# EAGLE design AeroQuad_v210 (EAGLE 5.11)
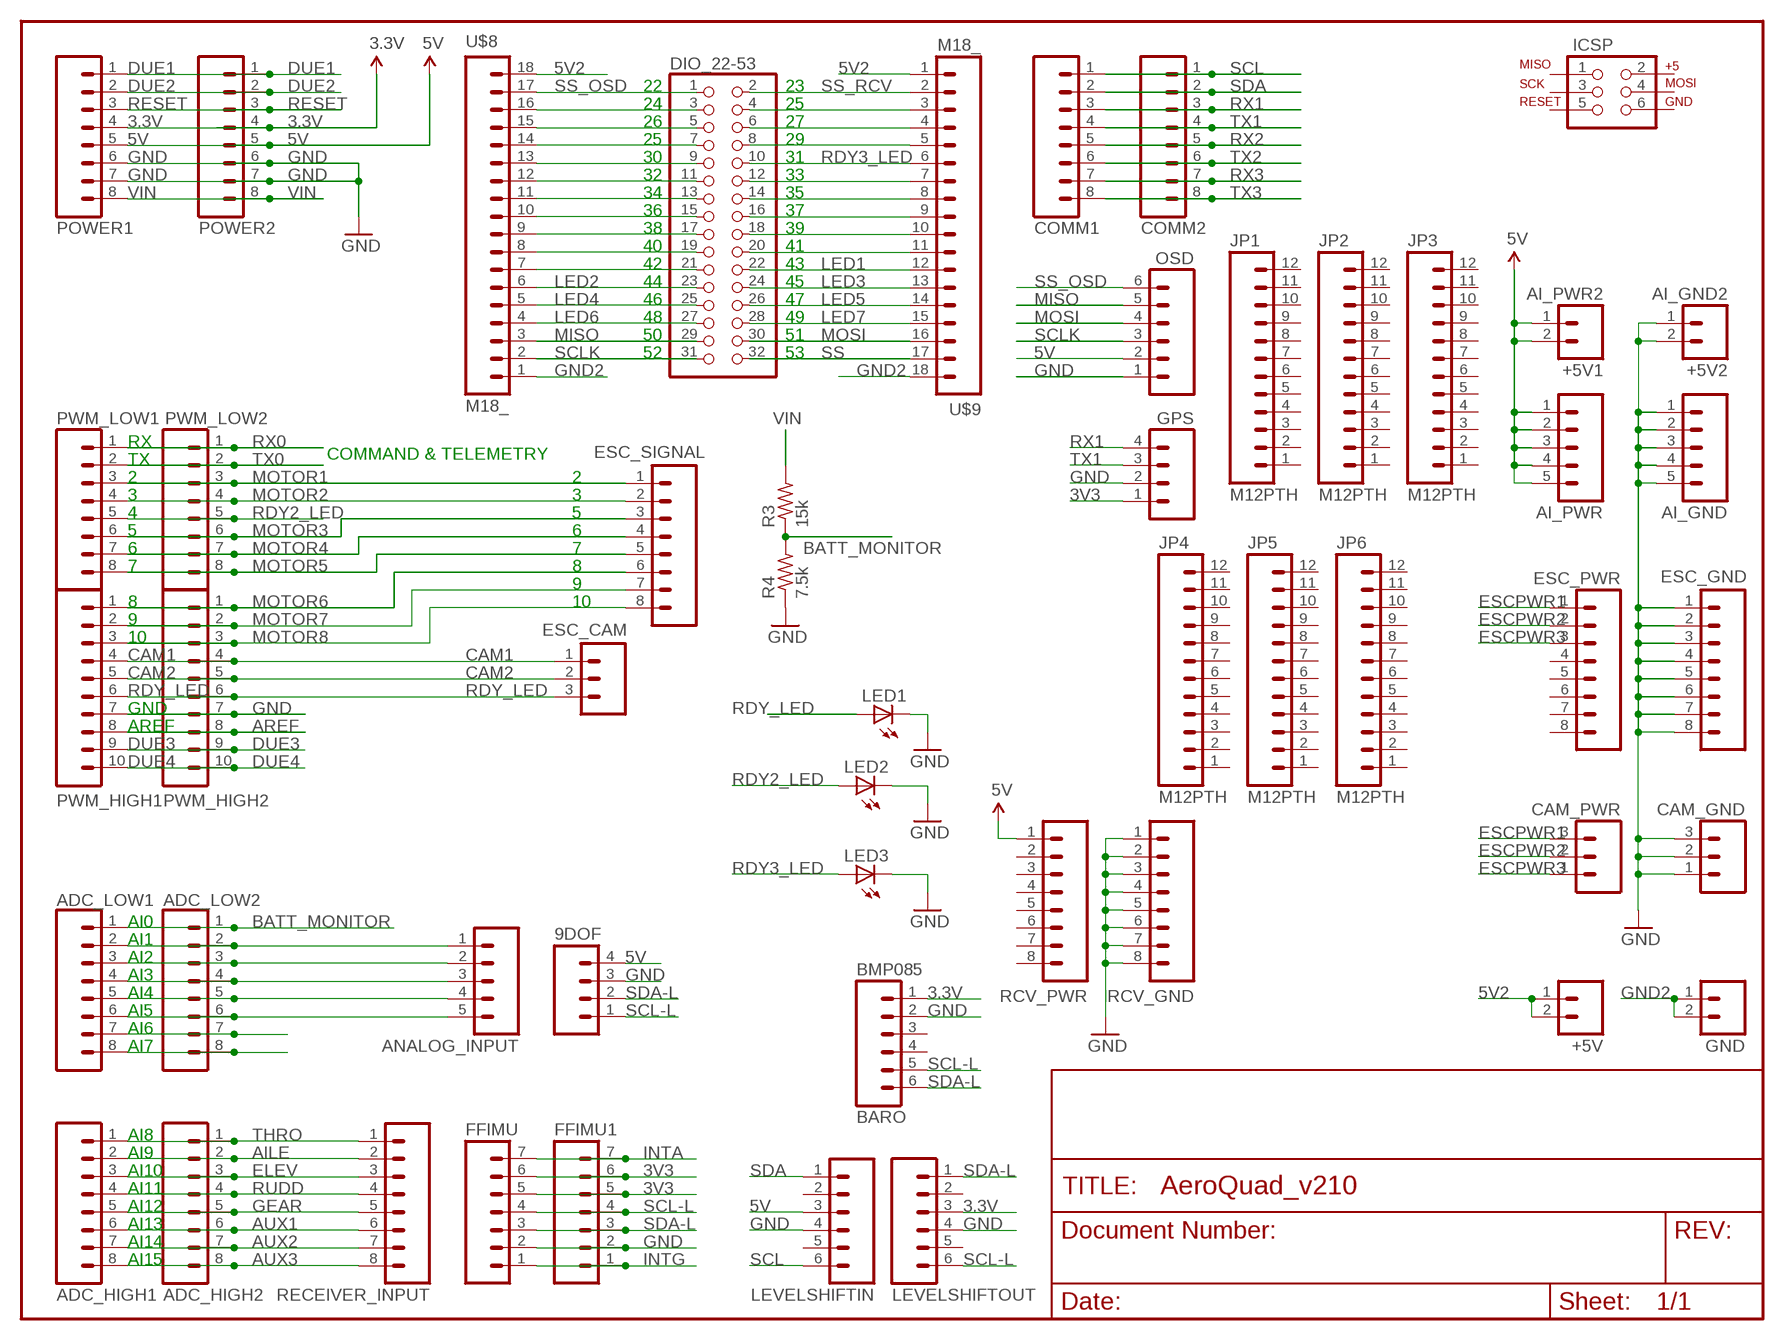
[diagram p0: schematic, sheet 1]

## Parts
9DOF  M04LOCK  [1X04_LOCK]
+5V  M02PTH  [1X02]
+5V1  AI_PWR2  M02PTH  [1X02]
+5V2  AI_GND2  M02PTH  [1X02]
ADC_HIGH1  M08LOCK  [1X08_LOCK]
ADC_HIGH2  M08LOCK  [1X08_LOCK]
ADC_LOW1  M08LOCK  [1X08_LOCK]
ADC_LOW2  M08LOCK  [1X08_LOCK]
AI_GND  M05LOCK  [1X05_LOCK]
AI_PWR  M05LOCK  [1X05_LOCK]
ANALOG_INPUT  M05LOCK  [1X05_LOCK]
BARO  BMP085  M06LOCK  [1X06_LOCK]
CAM_GND  M03LOCK  [1X03_LOCK]
CAM_PWR  M03LOCK  [1X03_LOCK]
COMM1  M08LOCK  [1X08_LOCK]
COMM2  M08LOCK  [1X08_LOCK]
DIO_22-53  PINHD-2X16  [2X16]
ESC_CAM  M03LOCK  [1X03_LOCK]
ESC_GND  M10LOCK  M08LOCK  [1X08_LOCK]
ESC_PWR  M10LOCK  M08LOCK  [1X08_LOCK]
ESC_SIGNAL  M10LOCK  M08LOCK  [1X08_LOCK]
FFIMU  M07LOCK  [1X07_LOCK]
FFIMU1  M07LOCK  [1X07_LOCK]
GND  M02PTH  [1X02]
GPS  M04LOCK  [1X04_LOCK]
ICSP  AVR_SPI_PRG_6NS  [2X3-NS]
JP1  M12PTH  [1X12]
JP2  M12PTH  [1X12]
JP3  M12PTH  [1X12]
JP4  M12PTH  [1X12]
JP5  M12PTH  [1X12]
JP6  M12PTH  [1X12]
LED1  LED5MM  [LED5MM]
LED2  LED5MM  [LED5MM]
LED3  LED5MM  [LED5MM]
LEVELSHIFTIN  M06LOCK  [1X06_LOCK]
LEVELSHIFTOUT  M06LOCK  [1X06_LOCK]
OSD  M06LOCK  [1X06_LOCK]
POWER1  M08LOCK  [1X08_LOCK]
POWER2  M08LOCK  [1X08_LOCK]
PWM_HIGH1  M10LOCK  [1X10_LOCK]
PWM_HIGH2  M10LOCK  [1X10_LOCK]
PWM_LOW1  M08LOCK  [1X08_LOCK]
PWM_LOW2  M08LOCK  [1X08_LOCK]
R3  15k  R-US_0204/5  [0204/5]
R4  7.5k  R-US_0204/5  [0204/5]
RCV_GND  M10LOCK  M08LOCK  [1X08_LOCK]
RCV_PWR  M10LOCK  M08LOCK  [1X08_LOCK]
RECEIVER_INPUT  M08LOCK  [1X08_LOCK]
U$8  M18_  [1X18]
U$9  M18_  [1X18]

## Nets
3.3V: BARO.1 LEVELSHIFTOUT.3 POWER1.4 POWER2.4
3V3: FFIMU1.5 FFIMU1.6 FFIMU.5 FFIMU.6 GPS.1
5V: 9DOF.4 +5V1.1 +5V1.2 AI_PWR.1 AI_PWR.2 AI_PWR.3 AI_PWR.4 AI_PWR.5 LEVELSHIFTIN.3 OSD.2 POWER1.5 POWER2.5 RCV_PWR.1
5V2: +5V.1 +5V.2 U$8.18 U$9.1
AILE: ADC_HIGH1.2 ADC_HIGH2.2 RECEIVER_INPUT.2
AREF: PWM_HIGH1.8 PWM_HIGH2.8
AUX1: ADC_HIGH1.6 ADC_HIGH2.6 RECEIVER_INPUT.6
AUX2: ADC_HIGH1.7 ADC_HIGH2.7 RECEIVER_INPUT.7
AUX3: ADC_HIGH1.8 ADC_HIGH2.8 RECEIVER_INPUT.8
BATT_MONITOR: ADC_LOW1.1 ADC_LOW2.1 R3.1 R4.2
CAM1: ESC_CAM.1 PWM_HIGH1.4 PWM_HIGH2.4
CAM2: ESC_CAM.2 PWM_HIGH1.5 PWM_HIGH2.5
DUE1: POWER1.1 POWER2.1
DUE2: POWER1.2 POWER2.2
DUE3: PWM_HIGH1.9 PWM_HIGH2.9
DUE4: PWM_HIGH1.10 PWM_HIGH2.10
ELEV: ADC_HIGH1.3 ADC_HIGH2.3 RECEIVER_INPUT.3
ESCPWR1: CAM_PWR.3 ESC_PWR.1
ESCPWR2: CAM_PWR.2 ESC_PWR.2
ESCPWR3: CAM_PWR.1 ESC_PWR.3
GEAR: ADC_HIGH1.5 ADC_HIGH2.5 RECEIVER_INPUT.5
GND: 9DOF.3 +5V2.1 +5V2.2 AI_GND.1 AI_GND.2 AI_GND.3 AI_GND.4 AI_GND.5 BARO.2 CAM_GND.1 CAM_GND.2 CAM_GND.3 ESC_GND.1 ESC_GND.2 ESC_GND.3 ESC_GND.4 ESC_GND.5 ESC_GND.6 ESC_GND.7 ESC_GND.8 FFIMU1.2 FFIMU.2 GPS.2 LED1.K(C) LED2.K(C) LED3.K(C) LEVELSHIFTIN.4 LEVELSHIFTOUT.4 OSD.1 POWER1.6 POWER1.7 POWER2.6 POWER2.7 PWM_HIGH1.7 PWM_HIGH2.7 R4.1 RCV_GND.1 RCV_GND.2 RCV_GND.3 RCV_GND.4 RCV_GND.5 RCV_GND.6 RCV_GND.7 RCV_GND.8
GND2: GND.1 GND.2 U$8.1 U$9.18
INTA: FFIMU1.7 FFIMU.7
INTG: FFIMU1.1 FFIMU.1
LED1: DIO_22-53.22 U$9.12
LED2: DIO_22-53.23 U$8.6
LED3: DIO_22-53.24 U$9.13
LED4: DIO_22-53.25 U$8.5
LED5: DIO_22-53.26 U$9.14
LED6: DIO_22-53.27 U$8.4
LED7: DIO_22-53.28 U$9.15
MISO: DIO_22-53.29 OSD.5 U$8.3
MOSI: DIO_22-53.30 OSD.4 U$9.16
MOTOR1: ESC_SIGNAL.1 PWM_LOW1.3 PWM_LOW2.3
MOTOR2: ESC_SIGNAL.2 PWM_LOW1.4 PWM_LOW2.4
MOTOR3: ESC_SIGNAL.3 PWM_LOW1.6 PWM_LOW2.6
MOTOR4: ESC_SIGNAL.4 PWM_LOW1.7 PWM_LOW2.7
MOTOR5: ESC_SIGNAL.5 PWM_LOW1.8 PWM_LOW2.8
MOTOR6: ESC_SIGNAL.6 PWM_HIGH1.1 PWM_HIGH2.1
MOTOR7: ESC_SIGNAL.7 PWM_HIGH1.2 PWM_HIGH2.2
MOTOR8: ESC_SIGNAL.8 PWM_HIGH1.3 PWM_HIGH2.3
N$1: DIO_22-53.11 U$8.12
N$2: DIO_22-53.9 U$8.13
N$3: DIO_22-53.7 U$8.14
N$4: ADC_LOW1.2 ADC_LOW2.2 ANALOG_INPUT.1
N$6: ADC_LOW1.3 ADC_LOW2.3 ANALOG_INPUT.2
N$7: ADC_LOW1.4 ADC_LOW2.4 ANALOG_INPUT.3
N$8: ADC_LOW1.5 ADC_LOW2.5 ANALOG_INPUT.4
N$9: ADC_LOW1.6 ADC_LOW2.6 ANALOG_INPUT.5
N$15: DIO_22-53.3 U$8.16
N$18: ADC_LOW1.7 ADC_LOW2.7
N$19: ADC_LOW1.8 ADC_LOW2.8
N$20: DIO_22-53.5 U$8.15
N$22: DIO_22-53.4 U$9.3
N$37: DIO_22-53.6 U$9.4
N$38: DIO_22-53.8 U$9.5
RDY2_LED: LED2.A PWM_LOW1.5 PWM_LOW2.5
RDY3_LED: DIO_22-53.10 LED3.A U$9.6
RDY_LED: ESC_CAM.3 LED1.A PWM_HIGH1.6 PWM_HIGH2.6
RESET: POWER1.3 POWER2.3
RUDD: ADC_HIGH1.4 ADC_HIGH2.4 RECEIVER_INPUT.4
RX0: PWM_LOW1.1 PWM_LOW2.1
RX1: COMM1.3 COMM2.3 GPS.4
RX2: COMM1.5 COMM2.5
RX3: COMM1.7 COMM2.7
SCL: COMM1.1 COMM2.1 LEVELSHIFTIN.6
SCL-L: 9DOF.1 BARO.5 FFIMU1.4 FFIMU.4 LEVELSHIFTOUT.6
SCLK: DIO_22-53.31 OSD.3 U$8.2
SDA: COMM1.2 COMM2.2 LEVELSHIFTIN.1
SDA-L: 9DOF.2 BARO.6 FFIMU1.3 FFIMU.3 LEVELSHIFTOUT.1
SERVO1: DIO_22-53.12 U$9.7
SERVO2: DIO_22-53.13 U$8.11
SERVO3: DIO_22-53.14 U$9.8
SERVO4: DIO_22-53.15 U$8.10
SERVO5: DIO_22-53.16 U$9.9
SERVO6: DIO_22-53.17 U$8.9
SERVO7: DIO_22-53.18 U$9.10
SERVO8: DIO_22-53.19 U$8.8
SERVO9: DIO_22-53.20 U$9.11
SERVO10: DIO_22-53.21 U$8.7
SS: DIO_22-53.32 U$9.17
SS_OSD: DIO_22-53.1 OSD.6 U$8.17
SS_RCV: DIO_22-53.2 U$9.2
THRO: ADC_HIGH1.1 ADC_HIGH2.1 RECEIVER_INPUT.1
TX0: PWM_LOW1.2 PWM_LOW2.2
TX1: COMM1.4 COMM2.4 GPS.3
TX2: COMM1.6 COMM2.6
TX3: COMM1.8 COMM2.8
VIN: POWER1.8 POWER2.8 R3.2
Unconnected: BARO.3 BARO.4 ESC_PWR.4 ESC_PWR.5 ESC_PWR.6 ESC_PWR.7 ESC_PWR.8 ICSP.1 ICSP.2 ICSP.3 ICSP.4 ICSP.5 ICSP.6 JP1.1 JP1.2 JP1.3 JP1.4 JP1.5 JP1.6 JP1.7 JP1.8 JP1.9 JP1.10 JP1.11 JP1.12 JP2.1 JP2.2 JP2.3 JP2.4 JP2.5 JP2.6 JP2.7 JP2.8 JP2.9 JP2.10 JP2.11 JP2.12 JP3.1 JP3.2 JP3.3 JP3.4 JP3.5 JP3.6 JP3.7 JP3.8 JP3.9 JP3.10 JP3.11 JP3.12 JP4.1 JP4.2 JP4.3 JP4.4 JP4.5 JP4.6 JP4.7 JP4.8 JP4.9 JP4.10 JP4.11 JP4.12 JP5.1 JP5.2 JP5.3 JP5.4 JP5.5 JP5.6 JP5.7 JP5.8 JP5.9 JP5.10 JP5.11 JP5.12 JP6.1 JP6.2 JP6.3 JP6.4 JP6.5 JP6.6 JP6.7 JP6.8 JP6.9 JP6.10 JP6.11 JP6.12 LEVELSHIFTIN.2 LEVELSHIFTIN.5 LEVELSHIFTOUT.2 LEVELSHIFTOUT.5 RCV_PWR.2 RCV_PWR.3 RCV_PWR.4 RCV_PWR.5 RCV_PWR.6 RCV_PWR.7 RCV_PWR.8

## Notes on the sheet
- 22 | 23
- 24 | 25
- 26 | 27
- 25 | 29
- 30 | 31
- 32 | 33
- 34 | 35
- 36 | 37
- 38 | 39
- 40 | 41
- 42 | 43
- 44 | 45
- 46 | 47
- 48 | 49
- 50 | 51
- 52 | 53
- RX
- COMMAND & TELEMETRY
- TX
- 2 | 2
- 3 | 3
- 4 | 5
- 5 | 6
- 6 | 7
- 7 | 8
- 9
- 8 | 10
- 9
- 10
- GND
- AREF
- AI0
- AI1
- AI2
- AI3
- AI4
- AI5
- AI6
- AI7
- AI8
- AI9
- AI10
- AI11
- AI12
- AI13
- AI14
- AI15

## Library data of the parts
9DOF GPS = SparkFun:M04: Header 4 Standard 4-pin 0.1" header. Use with straight break away headers (SKU : PRT-00116), right angle break away headers (PRT-00553), swiss pins (PRT-00743), machine pins (PRT-00117), and female headers (PRT-00115). Molex polarized connector foot print use with SKU : PRT-08231 with associated crimp pins and housings. 1MM SMD Version SKU: PRT-10208
+5V +5V1 +5V2 GND = SparkFun:M02: Header 2 Standard 2-pin 0.1" header. Use with straight break away headers (SKU : PRT-00116), right angle break away headers (PRT-00553), swiss pins (PRT-00743), machine pins (PRT-00117), and female headers (PRT-00115). Molex polarized connector foot print use with SKU : PRT-08233 with associated crimp pins and housings.
ADC_HIGH1 ADC_HIGH2 ADC_LOW1 ADC_LOW2 COMM1 COMM2 ESC_GND ESC_PWR ESC_SIGNAL POWER1 POWER2 PWM_LOW1 PWM_LOW2 RCV_GND RCV_PWR RECEIVER_INPUT = SparkFun:M08: Header 8 Standard 8-pin 0.1" header. Use with straight break away headers (SKU : PRT-00116), right angle break away headers (PRT-00553), swiss pins (PRT-00743), machine pins (PRT-00117), and female headers (PRT-00115).
AI_GND AI_PWR ANALOG_INPUT = SparkFun:M05: Header 5 Standard 5-pin 0.1" header. Use with straight break away headers (SKU : PRT-00116), right angle break away headers (PRT-00553), swiss pins (PRT-00743), machine pins (PRT-00117), and female headers (PRT-00115). Molex polarized connector foot print use with SKU : PRT-08230 with associated crimp pins and housings.
BARO LEVELSHIFTIN LEVELSHIFTOUT OSD = SparkFun:M06: Header 6 Standard 6-pin 0.1" header. Use with straight break away headers (SKU : PRT-00116), right angle break away headers (PRT-00553), swiss pins (PRT-00743), machine pins (PRT-00117), and female headers (PRT-00115). Molex polarized connector foot print use with SKU : PRT-08094 with associated crimp pins and housings. NOTES ON THE VARIANTS LOCK and LOCK_LONGPADS... This footprint was designed to help hold the alignment of a through-hole component (i.e. 6-pin header) while soldering it into place. You may notice that each hole has been shifted either up or down by 0.005 of an inch from it's more standard position (which is a perfectly straight line). This slight alteration caused the pins (the squares in the middle) to touch the edges of the holes. Because they are alternating, it causes a "brace" to hold the component in place. 0.005 has proven to be the perfect amount of "off-center" position when using our standard breakaway headers. Although looks a little odd when you look at the bare footprint, once you have a header in there, the alteration is very hard to notice. Also, if you push a header all the way into place, it is covered up entirely on the bottom side. This idea of altering the position of holes to aid alignment will be further integrated into the Sparkfun Library for other footprints. It can help hold any component with 3 or more connection pins.
CAM_GND CAM_PWR ESC_CAM = SparkFun:M03: Header 3 Standard 3-pin 0.1" header. Use with straight break away headers (SKU : PRT-00116), right angle break away headers (PRT-00553), swiss pins (PRT-00743), machine pins (PRT-00117), and female headers (PRT-00115). Molex polarized connector foot print use with SKU : PRT-08232 with associated crimp pins and housings.
DIO_22-53 = pinhead:PINHD-2X16: PIN HEADER
FFIMU FFIMU1 = SparkFun:M07: Header 7 Standard 7-pin 0.1" header. Use with straight break away headers (SKU : PRT-00116), right angle break away headers (PRT-00553), swiss pins (PRT-00743), machine pins (PRT-00117), and female headers (PRT-00115). NOTES ON THE VARIANTS LOCK and LOCK_LONGPADS... This footprint was designed to help hold the alignment of a through-hole component (i.e. 7-pin header) while soldering it into place. You may notice that each hole has been shifted either up or down by 0.005 of an inch from it's more standard position (which is usually a perfectly straight line). This slight alteration caused the pins (the squares in the middle) to touch the edges of the holes. Because they are alternating, it causes a "brace" to hold the header in place. 0.005 has proven to be the perfect amount of "off-center" position when using our standard breakaway headers. Although looks a little odd when you look at the bare footprint, once you have a header in there, the alteration is very hard to notice. Also, if you push a header all the way into place, it is covered up entirely on the bottom side. This idea of altering the position of holes to aid alignment will be further integrated into the Sparkfun Library for other footprints. It can help hold any component with 3 or more connection pins.
ICSP = SparkFun:AVR_SPI_PRG_6: AVR ISP 6 Pin This is the reduced ISP connector for AVR programming. Common on Arduino. This footprint will take up less PCB space and can be used with a 10-pin to 6-pin adapter such as SKU: BOB-08508
JP1-JP6 = SparkFun:M12: Header 12 Standard 12-pin 0.1" header. Use with straight break away headers (SKU : PRT-00116), right angle break away headers (PRT-00553), swiss pins (PRT-00743), machine pins (PRT-00117), and female headers (PRT-00115).
LED1-LED3 = SparkFun:LED: LEDs Standard schematic elements and footprints for 5mm, 3mm, 1206, and 0603 sized LEDs. 5mm - Spark Fun Electronics SKU : COM-00529 (and others)
PWM_HIGH1 PWM_HIGH2 = SparkFun:M10: Header 10 Standard 10-pin 0.1" header. Use with straight break away headers (SKU : PRT-00116), right angle break away headers (PRT-00553), swiss pins (PRT-00743), machine pins (PRT-00117), and female headers (PRT-00115).
R3 R4 = resistor:R-US_: RESISTOR, American symbol
U$8 U$9 = SparkFun:M18

## Board
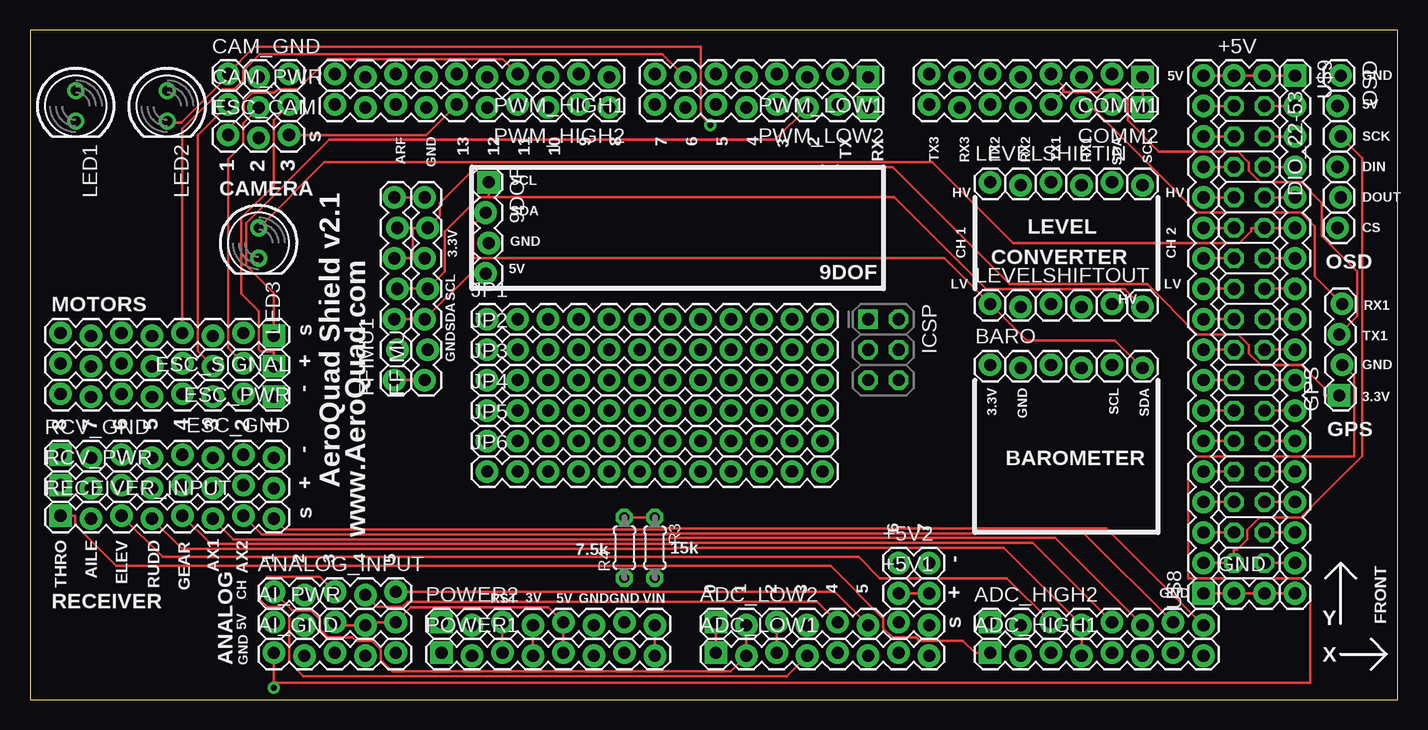
[diagram p1: board, top side]
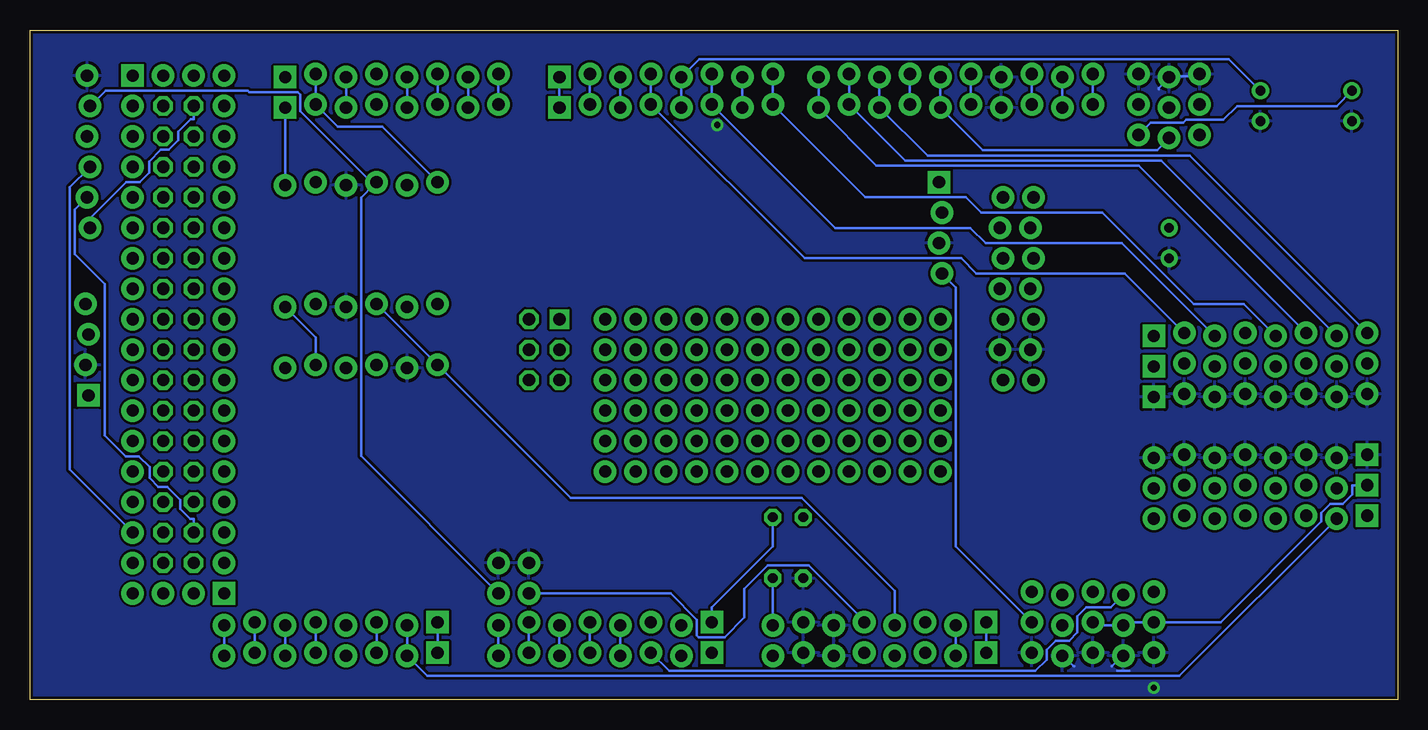
[diagram p2: board, bottom side, seen from below]

Size 113.97 x 55.87 mm. Coordinates in mm from the lower left corner, seen from the top.
Outline: 0,0 113.97,0 113.97,55.87 0,55.87 0,0
Copper layers (1*16): Top 0.035mm / dielectric 1.5mm / Bottom 0.035mm
Design rules "SparkFun": minimum track width 8mil, minimum drill 20mil, track to track 8mil, track to pad 8mil, pad to pad 8mil, via to via 8mil, smd to smd 8mil, copper to edge 10mil, drill to drill 8mil, minimum pad ring 12mil, minimum via ring 10mil, stop-mask expansion 4mil, vias tented up to drill 25mil, thermal gap 10mil

### Footprints (pad centres in the part's own frame; a part is rotated, then mirrored left to right if it is on the bottom)
1X04_LOCK = drill 1.016 pad 1.88 square: 1 0,0.127 | drill 1.016 pad 1.88 round: 2 2.54,-0.127; 3 5.08,0.127; 4 7.62,-0.127
1X02 = drill 1.016 pad 1.88 round: 1 0,0; 2 2.54,0
1X08_LOCK = drill 1.016 pad 1.88 square: 1 0,0.127 | drill 1.016 pad 1.88 round: 2 2.54,-0.127; 3 5.08,0.127; 4 7.62,-0.127; 5 10.16,0.127; 6 12.7,-0.127; 7 15.24,0.127; 8 17.78,-0.127
1X05_LOCK = drill 1.016 pad 1.88 round: 1 0,0.127; 2 2.54,-0.127; 3 5.08,0.127; 4 7.62,-0.127; 5 10.16,0.127
1X06_LOCK = drill 1.016 pad 1.88 round: 1 0,0; 2 2.54,-0.254; 3 5.08,0; 4 7.62,-0.254; 5 10.16,0; 6 12.7,-0.254
1X03_LOCK = drill 1.016 pad 1.88 round: 1 0,0.127; 2 2.54,-0.127; 3 5.08,0.127
2X16 = drill 1.016 octagon: 1 -19.05,-1.27; 2 -19.05,1.27; 3 -16.51,-1.27; 4 -16.51,1.27; 5 -13.97,-1.27; 6 -13.97,1.27; 7 -11.43,-1.27; 8 -11.43,1.27; 9 -8.89,-1.27; 10 -8.89,1.27; 11 -6.35,-1.27; 12 -6.35,1.27; 13 -3.81,-1.27; 14 -3.81,1.27; 15 -1.27,-1.27; 16 -1.27,1.27; 17 1.27,-1.27; 18 1.27,1.27; 19 3.81,-1.27; 20 3.81,1.27; 21 6.35,-1.27; 22 6.35,1.27; 23 8.89,-1.27; 24 8.89,1.27; 25 11.43,-1.27; 26 11.43,1.27; 27 13.97,-1.27; 28 13.97,1.27; 29 16.51,-1.27; 30 16.51,1.27; 31 19.05,-1.27; 32 19.05,1.27
1X07_LOCK = drill 1.016 pad 1.88 round: 1 0,0.127; 2 2.54,-0.127; 3 5.08,0.127; 4 7.62,-0.127; 5 10.16,0.127; 6 12.7,-0.127; 7 15.24,0.127
2X3-NS = drill 1.016 square: 1 -2.54,-1.27 | drill 1.016 octagon: 2 -2.54,1.27; 3 0,-1.27; 4 0,1.27; 5 2.54,-1.27; 6 2.54,1.27
1X12 = drill 1.016 pad 1.88 round: 1 0,0; 2 2.54,0; 3 5.08,0; 4 7.62,0; 5 10.16,0; 6 12.7,0; 7 15.24,0; 8 17.78,0; 9 20.32,0; 10 22.86,0; 11 25.4,0; 12 27.94,0
LED5MM = drill 0.813 round: A -1.27,0; K 1.27,0
1X10_LOCK = drill 1.016 pad 1.88 round: 1 0,0.127; 2 2.54,-0.127; 3 5.08,0.127; 4 7.62,-0.127; 5 10.16,0.127; 6 12.7,-0.127; 7 15.24,0.127; 8 17.78,-0.127; 9 20.32,0.127; 10 22.86,-0.127
0204/5 = drill 0.813 octagon: 1 -2.54,0; 2 2.54,0
1X18 = drill 1.016 pad 1.88 square: 1 0,0 | drill 1.016 pad 1.88 round: 2 2.54,0; 3 5.08,0; 4 7.62,0; 5 10.16,0; 6 12.7,0; 7 15.24,0; 8 17.78,0; 9 20.32,0; 10 22.86,0; 11 25.4,0; 12 27.94,0; 13 30.48,0; 14 33.02,0; 15 35.56,0; 16 38.1,0; 17 40.64,0; 18 43.18,0

### Placement (x,y rotation side)
9DOF  38.1,43.18 270 top
+5V  100.33,52.07 0 top
+5V1  72.39,8.89 0 top
+5V2  72.39,11.43 0 top
ADC_HIGH1  80.01,3.81 0 top
ADC_HIGH2  80.01,6.35 0 top
ADC_LOW1  57.15,3.81 0 top
ADC_LOW2  57.15,6.35 0 top
AI_GND  20.32,3.81 0 top
AI_PWR  20.32,6.35 0 top
ANALOG_INPUT  20.32,8.89 0 top
BARO  80.01,27.94 0 top
CAM_GND  16.51,52.07 0 top
CAM_PWR  16.51,49.53 0 top
COMM1  92.71,52.07 180 top
COMM2  92.71,49.53 180 top
DIO_22-53  101.6,30.48 270 top
ESC_CAM  16.51,46.99 0 top
ESC_GND  20.32,25.4 180 top
ESC_PWR  20.32,27.94 180 top
ESC_SIGNAL  20.32,30.48 180 top
FFIMU  33.02,26.67 90 top
FFIMU1  30.48,26.67 90 top
GND  100.33,8.89 0 top
GPS  109.22,25.4 90 top
ICSP  71.12,29.21 270 top
JP1  38.1,31.75 0 top
JP2  38.1,29.21 0 top
JP3  38.1,26.67 0 top
JP4  38.1,24.13 0 top
JP5  38.1,21.59 0 top
JP6  38.1,19.05 0 top
LED1  3.81,49.53 270 top
LED2  11.43,49.53 270 top
LED3  19.05,38.1 270 top
LEVELSHIFTIN  80.01,43.18 0 top
LEVELSHIFTOUT  80.01,33.02 0 top
OSD  109.22,52.07 270 top
POWER1  34.29,3.81 0 top
POWER2  34.29,6.35 0 top
PWM_HIGH1  48.26,52.07 180 top
PWM_HIGH2  48.26,49.53 180 top
PWM_LOW1  69.85,52.07 180 top
PWM_LOW2  69.85,49.53 180 top
R3  52.07,12.7 270 top
R4  49.53,12.7 90 top
RCV_GND  2.54,20.32 0 top
RCV_PWR  2.54,17.78 0 top
RECEIVER_INPUT  2.54,15.24 0 top
U$8  97.79,8.89 90 top
U$9  105.41,52.07 270 top

### Tracks (layer width: path | path; a pad name or v marks a point on that pad's centre or on a via)
3.3V
  Top 0.203: POWER1.4 POWER2.4
  Bottom 0.203: POWER2.4 41.91,9.08 49.67,16.84 68.91,16.84 BARO.1 LEVELSHIFTOUT.3
3V3
  Top 0.203: GPS.1 107.85,25.4 107.85,26.02 105.93,27.94 102.54,27.94 101.58,28.91 101.58,29.6 100.69,30.48 97.29,30.48 93.1,34.67 81.66,34.67 71.91,44.42 37.16,44.42 34.15,41.42 34.15,40.38 FFIMU.6 31.88,39.37 | 31.88,39.37 FFIMU1.6 | 31.88,36.83 FFIMU.5 | FFIMU1.5 31.88,36.83 | 31.88,36.83 31.88,39.37
5V
  Top 0.203: AI_PWR.3 25.65,6.22 AI_PWR.4 28.19,6.48 AI_PWR.5 31.73,7.73 43.2,7.73 POWER2.5 POWER1.5 | +5V1.1 +5V1.2
  Bottom 0.203: AI_PWR.5 36.81,12.81 36.81,34.4 9DOF.4 | 85.31,42.96 LEVELSHIFTIN.3 | +5V1.2 86.39,20.34 86.39,41.88 85.31,42.96 | OSD.2 107.68,50.82 95.84,50.82 95.69,50.67 91.67,50.67 91.47,50.47 91.47,49.12 85.31,42.96 | POWER2.5 44.45,6.61 49.05,11.21 52.47,11.21 54.43,9.25 54.43,6.88 56.08,5.23 58.25,5.23 58.4,5.38 58.4,6.7 60.59,8.89 +5V1.1 | AI_PWR.3 25.15,6.22 AI_PWR.2 22.61,6.48 AI_PWR.1 14.75,6.48 6.35,14.87 6.35,15.61 5.61,16.36 4.56,16.36 3.79,17.13 3.79,17.91 RCV_PWR.1
5V2
  Top 0.203: U$9.1 +5V.2 +5V.1 U$8.18
AILE
  Bottom 0.203: ADC_HIGH2.2 ADC_HIGH1.2 80.87,2 18.19,2 RECEIVER_INPUT.2
AREF
  Bottom 0.203: PWM_HIGH2.8 PWM_HIGH1.8
AUX1
  Top 0.203: ADC_HIGH2.6 85.43,13.5 53.31,13.5 53.22,13.41 16.94,13.41 RECEIVER_INPUT.6
  Bottom 0.203: ADC_HIGH2.6 ADC_HIGH1.6
AUX2
  Top 0.203: ADC_HIGH2.7 87.82,13.91 53.14,13.91 53.05,13.82 19.33,13.82 RECEIVER_INPUT.7
  Bottom 0.203: ADC_HIGH2.7 ADC_HIGH1.7
AUX3
  Top 0.203: ADC_HIGH2.8 89.7,14.32 52.98,14.32 52.88,14.22 21.21,14.22 RECEIVER_INPUT.8
  Bottom 0.203: ADC_HIGH2.8 ADC_HIGH1.8
BATT_MONITOR
  Top 0.203: ADC_LOW1.1 ADC_LOW2.1 | R3.1 R4.2
  Bottom 0.203: ADC_LOW2.1 57.15,7.72 52.07,12.8 R3.1
CAM1
  Top 0.203: PWM_HIGH1.4 39.39,53.44 24.82,53.44 22.33,50.95 20.68,50.95 20.37,50.65 18.53,50.65 17.8,49.93 17.8,48.92 16.51,47.62 ESC_CAM.1
  Bottom 0.203: PWM_HIGH1.4 PWM_HIGH2.4
CAM2
  Bottom 0.203: ESC_CAM.2 20.05,45.86 34.56,45.86 PWM_HIGH2.5 PWM_HIGH1.5
DUE1
  Bottom 0.203: POWER1.1 POWER2.1
DUE2
  Bottom 0.203: POWER1.2 POWER2.2
DUE3
  Bottom 0.203: PWM_HIGH2.9 PWM_HIGH1.9
DUE4
  Bottom 0.203: PWM_HIGH2.10 PWM_HIGH1.10
ELEV
  Top 0.203: RECEIVER_INPUT.3 11.06,11.93 69.05,11.93 70.82,10.16 81.41,10.16 ADC_HIGH2.3
  Bottom 0.203: ADC_HIGH2.3 ADC_HIGH1.3
ESCPWR1
  Top 0.203: CAM_PWR.3 20.3,48.36 20.3,42.91 17.62,40.23 17.62,33.91 19.07,32.45 19.07,29.21 19.23,29.06 20.32,29.06 ESC_PWR.1
ESCPWR2
  Top 0.203: ESC_PWR.2 16.51,29.34 16.51,45.1 17.75,46.35 17.75,48.11 CAM_PWR.2
ESCPWR3
  Top 0.203: ESC_PWR.3 13.97,29.08 13.97,47.12 CAM_PWR.1
GEAR
  Top 0.203: 15.06,13 RECEIVER_INPUT.5 | 15.06,13 | 15.06,13 53.39,13 53.48,13.1 83.55,13.1 ADC_HIGH2.5
  Bottom 0.203: ADC_HIGH2.5 ADC_HIGH1.5
GND  (via drill 0.51)
  Top 0.203: LED2.K 11.58,48.16 12.6,48.16 16.46,52.02 CAM_GND.1 16.46,52.22 18.69,54.46 55.88,54.46 55.88,48.77 v56.69,47.95 | 20.32,1.42 v20.32,1.02 20.32,1.42 | 20.32,1.42 20.32,3.86 AI_GND.1 | 20.32,1.42 106.68,1.42 106.68,9.55 106.07,10.16 96.52,10.16 96.52,19.71 97.13,20.32 110.34,20.32 110.34,27.03 109.53,27.84 GPS.2
  Bottom 0.203: AI_GND.2 22.96,3.66 23.77,2.85 23.83,2.79 | 22.35,2.44 23.37,2.44 | 26.93,2.82 27.03,2.85 27.84,3.66 AI_GND.4 | 19.91,50.94 19.91,51 19.1,51.82 CAM_GND.2 18.9,52.02 16.66,52.02 CAM_GND.1
  pour Bottom: 0,0 0,55.88 114.3,55.88 114.3,0
GND2
  Top 0.203: U$8.1 GND.1 GND.2 U$9.18
INTA
  Top 0.203: FFIMU1.7 FFIMU.7
INTG
  Top 0.203: FFIMU1.1 FFIMU.1
LED1
  Top 0.203: DIO_22-53.22 U$9.12
LED2
  Top 0.203: U$8.6 DIO_22-53.23
LED3
  Top 0.203: DIO_22-53.24 U$9.13
LED4
  Top 0.203: U$8.5 DIO_22-53.25
LED5
  Top 0.203: DIO_22-53.26 U$9.14
LED6
  Top 0.203: U$8.4 DIO_22-53.27
LED7
  Top 0.203: DIO_22-53.28 U$9.15
MISO
  Top 0.203: U$8.3 DIO_22-53.29
  Bottom 0.203: DIO_22-53.29 100.33,15.09 100.61,15.09 101.45,15.93 101.45,16.68 102.54,17.78 103.27,17.78 103.99,18.5 103.99,19.41 104.89,20.32 106,20.32 107.74,22.07 107.74,34.7 110.24,37.2 110.24,40.89 OSD.5
MOSI
  Top 0.203: DIO_22-53.30 U$9.16
  Bottom 0.203: U$9.16 110.65,19.21 110.65,42.77 OSD.4
MOTOR1
  Top 0.203: PWM_LOW2.3 62.08,46.71 24.95,46.71 18.02,39.78 18.02,36.22 20.32,33.92 ESC_SIGNAL.1
  Bottom 0.203: PWM_LOW2.3 PWM_LOW1.3
MOTOR2
  Bottom 0.203: ESC_SIGNAL.2 22.73,35.56 35.1,35.56 36.37,36.83 49.4,36.83 PWM_LOW2.4 PWM_LOW1.4
MOTOR3
  Bottom 0.203: ESC_SIGNAL.3 22.99,38.1 34.34,38.1 35.6,39.37 46.86,39.37 PWM_LOW2.6 PWM_LOW1.6
MOTOR4
  Top 0.203: PWM_LOW1.7 52.7,53.85 19.15,53.85 17.78,52.48 17.78,51.68 17.03,50.93 16,50.93 12.7,47.63 ESC_SIGNAL.4
  Bottom 0.203: PWM_LOW1.7 PWM_LOW2.7
MOTOR5
  Bottom 0.203: ESC_SIGNAL.5 12.83,33.02 16.99,33.02 24.61,40.64 34.7,40.64 35.99,41.94 44.35,41.94 PWM_LOW2.8 PWM_LOW1.8
MOTOR6
  Bottom 0.203: ESC_SIGNAL.6 21.59,44.57 43.43,44.57 PWM_HIGH2.1 PWM_HIGH1.1
MOTOR7
  Bottom 0.203: ESC_SIGNAL.7 19.71,44.98 41.04,44.98 PWM_HIGH2.2 PWM_HIGH1.2
MOTOR8
  Bottom 0.203: ESC_SIGNAL.8 17.32,45.39 39.16,45.39 PWM_HIGH2.3 PWM_HIGH1.3
N$1
  Top 0.203: U$8.12 DIO_22-53.11
N$2
  Top 0.203: U$8.13 DIO_22-53.9
N$3
  Top 0.203: U$8.14 DIO_22-53.7
N$4
  Top 0.203: ANALOG_INPUT.1 21.87,7.47 23.39,7.47 24.13,6.72 24.13,5.94 24.87,5.21 26.87,5.21 27.15,4.93 28.46,4.93 29.21,4.18 29.21,3.36 30.17,2.4 58.41,2.4 ADC_LOW1.2 ADC_LOW2.2
N$6
  Top 0.203: ADC_LOW1.3 ADC_LOW2.3
  Bottom 0.203: ANALOG_INPUT.2 23.9,7.72 25.93,7.72 26.7,6.96 26.7,5.64 27.38,4.95 28.48,4.95 29.23,4.19 29.23,3.37 30.19,2.41 60.7,2.41 ADC_LOW1.3
N$7
  Top 0.203: ANALOG_INPUT.3 24.15,10.27 19.77,10.27 19.07,9.56 19.07,8.46 19.75,7.77 20.85,7.77 21.59,7.04 21.59,3.17 22.79,1.97 63.06,1.97 ADC_LOW1.4
  Bottom 0.203: ADC_LOW1.4 ADC_LOW2.4
N$8
  Top 0.203: ANALOG_INPUT.4 28.96,7.75 31.04,7.75 31.47,8.18 65.6,8.18 ADC_LOW2.5
  Bottom 0.203: ADC_LOW2.5 ADC_LOW1.5
N$9
  Top 0.203: ANALOG_INPUT.5 67.06,9.02 ADC_LOW2.6
  Bottom 0.203: ADC_LOW2.6 ADC_LOW1.6
N$15
  Top 0.203: U$8.16 DIO_22-53.3
N$18
  Bottom 0.203: ADC_LOW1.7 ADC_LOW2.7
N$19
  Bottom 0.203: ADC_LOW1.8 ADC_LOW2.8
N$20
  Top 0.203: U$8.15 DIO_22-53.5
N$22
  Top 0.203: DIO_22-53.4 U$9.3
N$37
  Top 0.203: DIO_22-53.6 U$9.4
N$38
  Top 0.203: DIO_22-53.8 U$9.5
RDY2_LED
  Bottom 0.203: LED2.A 14.08,53.45 58.19,53.45 PWM_LOW1.5 PWM_LOW2.5
RDY3_LED
  Top 0.203: LED3.A 24.52,44.84 75.19,44.84 81.92,38.1 100.76,38.1 101.75,39.09 101.75,39.37 DIO_22-53.10 U$9.6
RDY_LED
  Top 0.203: PWM_HIGH2.6 33.02,47.12 ESC_CAM.3
  Bottom 0.203: ESC_CAM.3 20.57,48.14 17.86,48.14 17.62,48.39 14.53,48.39 13.38,49.53 5.08,49.53 LED1.A | PWM_HIGH2.6 PWM_HIGH1.6
RESET
  Top 0.203: POWER1.3 POWER2.3
RUDD
  Top 0.203: RECEIVER_INPUT.4 12.68,12.6 53.56,12.6 53.65,12.69 81.16,12.69 ADC_HIGH2.4 ADC_HIGH1.4
RX0
  Bottom 0.203: PWM_LOW2.1 PWM_LOW1.1
RX1
  Top 0.203: GPS.4 107.07,35.3 107.07,39.47 105.9,40.64 97.29,40.64 88.53,49.4 COMM2.3
  Bottom 0.203: COMM2.3 COMM1.3
RX2
  Bottom 0.203: COMM2.5 COMM1.5
RX3
  Bottom 0.203: COMM2.7 COMM1.7
SCL
  Top 0.203: COMM2.1 COMM1.1
  Bottom 0.203: LEVELSHIFTIN.6 COMM2.1
SCL-L
  Top 0.203: LEVELSHIFTOUT.6 91.21,34.27 79.67,34.27 72,41.94 38.23,41.94 | FFIMU1.4 FFIMU.4 34.56,35.7 34.56,39.05 37.45,41.94 38.23,41.94 | 38.23,41.94 9DOF.1
  Bottom 0.203: LEVELSHIFTOUT.6 90.17,30.23 BARO.5
SCLK
  Top 0.203: OSD.3 111.03,45.18 111.03,20.37 105.9,15.24 102.49,15.24 101.45,14.2 101.45,13.39 100.61,12.55 100.33,12.55 DIO_22-53.31 U$8.2
SDA
  Bottom 0.203: LEVELSHIFTIN.1 84.63,47.8 88.32,47.8 COMM2.2 COMM1.2
SDA-L
  Top 0.203: 36.92,36.83 36.68,36.59 36.68,35.53 FFIMU.3 FFIMU1.3 | 36.92,36.83 76.2,36.83 LEVELSHIFTOUT.1 83.05,29.98 90.41,29.98 BARO.6 | 36.92,36.83 36.92,39.59 9DOF.2
SERVO1
  Top 0.203: DIO_22-53.12 U$9.7
SERVO2
  Top 0.203: U$8.11 DIO_22-53.13
SERVO3
  Top 0.203: DIO_22-53.14 U$9.8
SERVO4
  Top 0.203: U$8.10 DIO_22-53.15
SERVO5
  Top 0.203: DIO_22-53.16 U$9.9
SERVO6
  Top 0.203: U$8.9 DIO_22-53.17
SERVO7
  Top 0.203: DIO_22-53.18 U$9.10
SERVO8
  Top 0.203: U$8.8 DIO_22-53.19
SERVO9
  Top 0.203: DIO_22-53.20 U$9.11
SERVO10
  Top 0.203: U$8.7 DIO_22-53.21
SS
  Top 0.203: DIO_22-53.32 U$9.17
SS_OSD
  Top 0.203: U$8.17 DIO_22-53.1
  Bottom 0.203: DIO_22-53.1 100.33,48.41 100.56,48.41 101.6,47.37 101.6,46.66 102.39,45.87 103.09,45.87 104.05,44.91 104.05,43.96 104.83,43.18 105.96,43.18 108.97,40.17 OSD.6
SS_RCV
  Top 0.203: DIO_22-53.2 U$9.2
THRO
  Top 0.203: ADC_HIGH1.1 78.77,3.94 77.75,4.95 74.12,4.95 73.86,5.21 71.88,5.21 71.12,5.97 71.12,6.79 66.71,11.2 7.18,11.2 3.79,14.59 3.79,15.37 RECEIVER_INPUT.1
  Bottom 0.203: ADC_HIGH1.1 ADC_HIGH2.1
TX0
  Bottom 0.203: PWM_LOW2.2 PWM_LOW1.2
TX1
  Top 0.203: COMM2.4 86.11,50.67 | GPS.3 110.62,32.01 110.62,35.72 107.66,38.68 107.66,41.45 105.92,43.18 102.52,43.18 101.58,44.13 101.58,44.83 100.68,45.72 94.08,45.72 91.47,48.34 91.47,50.2 90.77,50.9 89.2,50.9 88.98,50.67 86.11,50.67 | 86.11,50.67 86.11,51.18 COMM1.4
TX2
  Bottom 0.203: COMM2.6 COMM1.6
TX3
  Bottom 0.203: COMM2.8 COMM1.8
VIN
  Top 0.203: POWER1.8 POWER2.8
  Bottom 0.203: POWER2.8 R3.2

### Text on the board
tPlace: 5V | GND | 5V | s | ARF | GND | 13 | 12 | 11 | 10 | 9 | 8 | 7 | 6 | 5 | 4 | 3 | 2 | TX | RX | TX3 | RX3 | TX2 | RX2 | TX1 | RX1 | SDA | SCL | SCK | 1 | 2 | 3 | DIN | SCL | CAMERA | AeroQuad Shield v2.1 | HV | HV | DOUT | SDA | LEVEL | 3.3V | CS | GND | CONVERTER | CH 1 | CH 2 | 5V | OSD | 9DOF | LV | LV | SCL | HV | RX1 | MOTORS | s | SDA | TX1 | + | GND | GND | - | 3.3V | GND | SCL | SDA | 3.3V | 8 | 7 | 6 | 5 | 4 | 3 | 2 | 1 | GPS | - | BAROMETER | + | s | www.AeroQuad.com | 6 | 7 | THRO | AILE | ELEV | RUDD | GEAR | AX1 | AX2 | 7.5k | 15k | - | 1 | 2 | 3 | 4 | 5 | + | RST | 5V | GND | GND | VIN | 0 | 1 | 2 | 3 | 4 | 5 | GND | RECEIVER | CH | 3V | s | 5V | Y | FRONT | ANALOG | GND | X